# Altium schematic sheet Sheet1.SchDoc
size A4; SheetNumber: 1; SheetTotal: 3
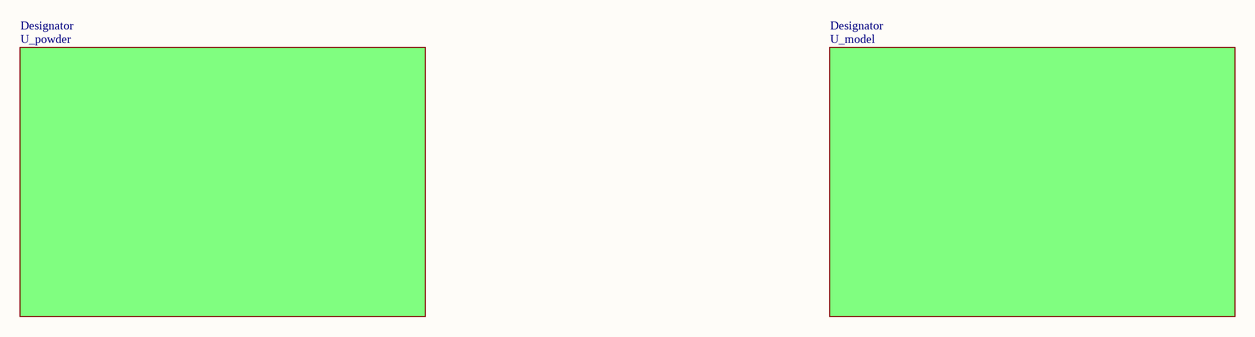
[diagram p0: Sheet1.SchDoc]

## Sub-sheets
Designator = U_powder: no entries
Designator = U_model: no entries